# EAGLE design driver (EAGLE 9.6.2)
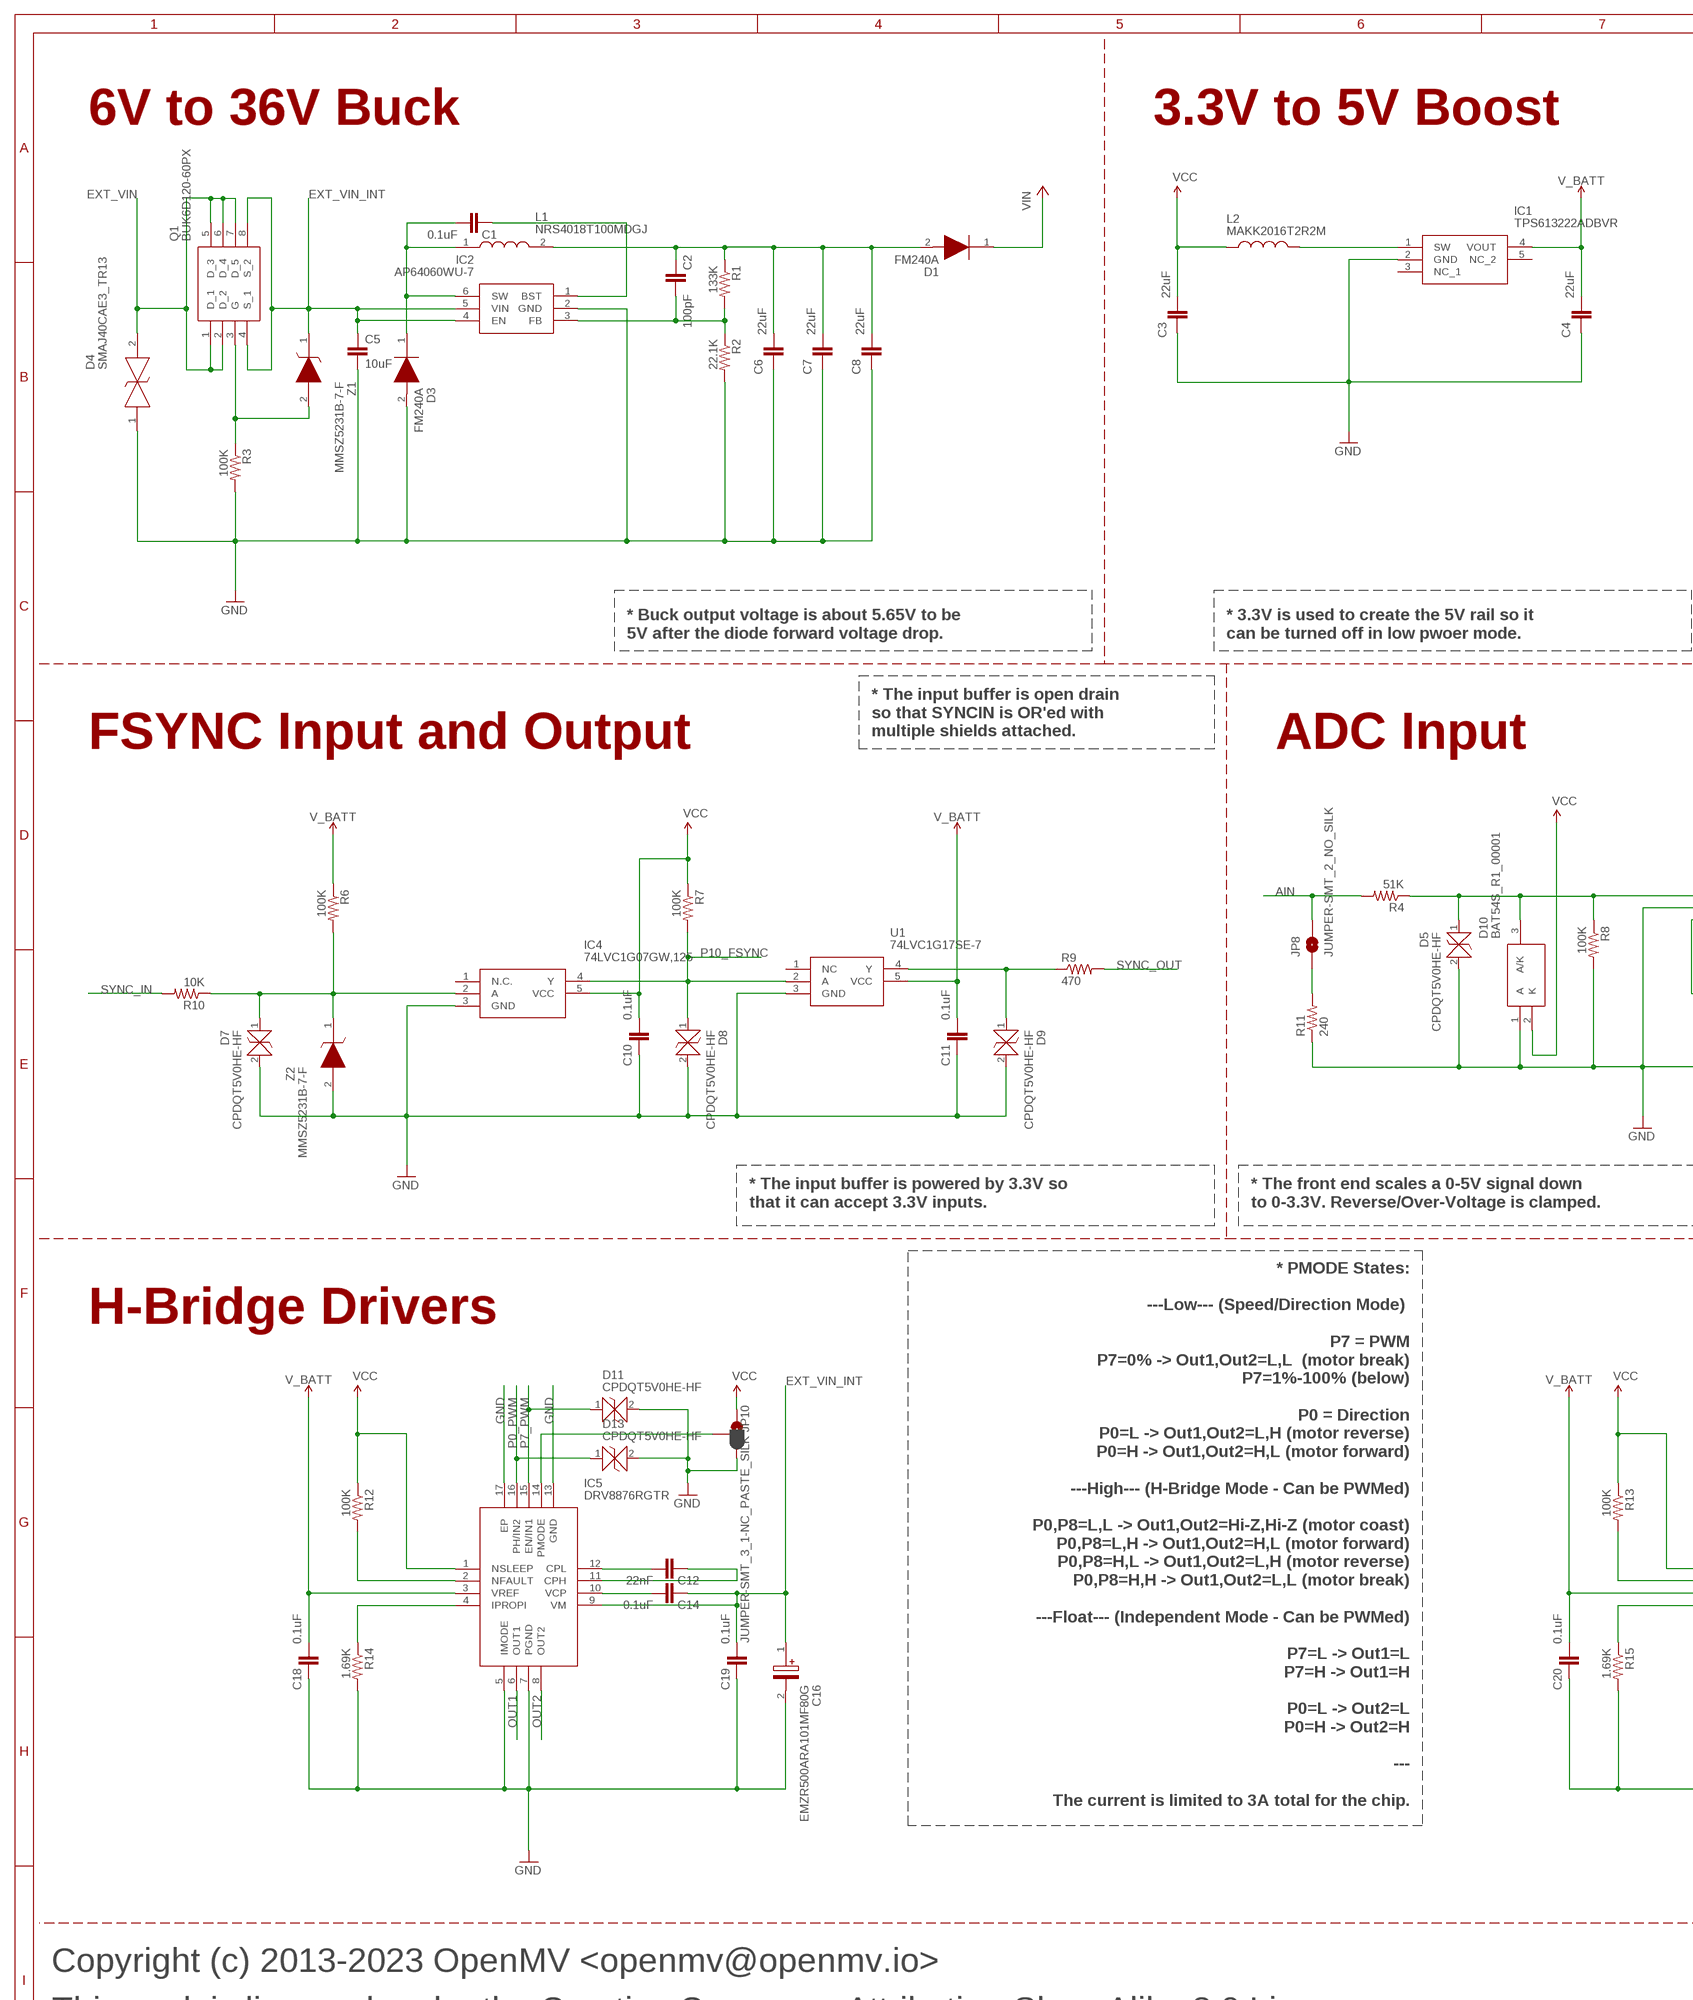
[diagram p0: schematic, sheet 1, part 1 of 2]
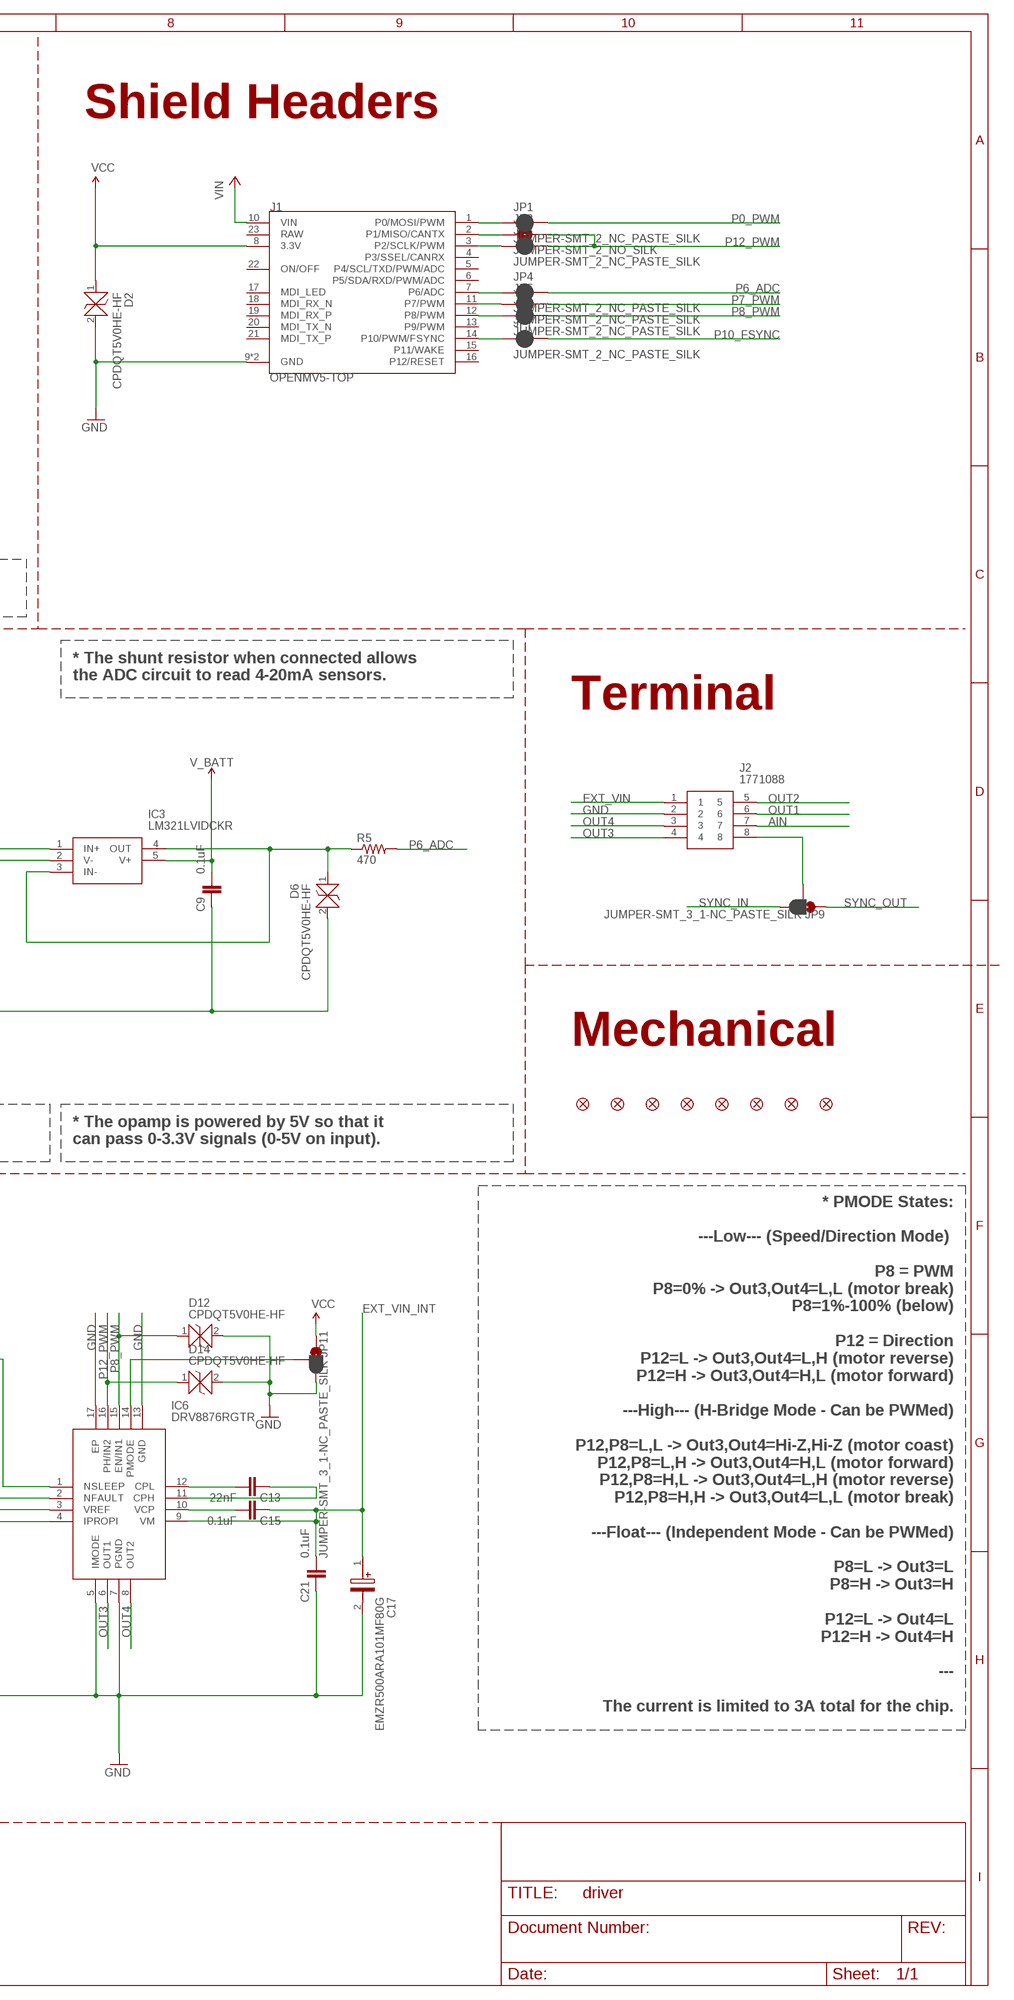
[diagram p1: schematic, sheet 1, part 2 of 2]

## Parts
C1  0.1uF  CAP0402-CAP  [0402-CAP]
C2  100pF  CAP0402-CAP  [0402-CAP]
C3  22uF  22UF-0805-6.3V-20%  [0805]
C4  22uF  22UF-0805-6.3V-20%  [0805]
C5  10uF  C-EUC0805  [C0805]
C6  22uF  22UF-0805-6.3V-20%  [0805]
C7  22uF  22UF-0805-6.3V-20%  [0805]
C8  22uF  22UF-0805-6.3V-20%  [0805]
C9  0.1uF  CAP0402-CAP  [0402-CAP]
C10  0.1uF  CAP0402-CAP  [0402-CAP]
C11  0.1uF  CAP0402-CAP  [0402-CAP]
C12  22nF  CAP0402-CAP  [0402-CAP]
C13  22nF  CAP0402-CAP  [0402-CAP]
C14  0.1uF  CAP0402-CAP  [0402-CAP]
C15  0.1uF  CAP0402-CAP  [0402-CAP]
C16  EMZR500ARA101MF80G  [CAPAE660X820N]
C17  EMZR500ARA101MF80G  [CAPAE660X820N]
C18  0.1uF  CAP0402-CAP  [0402-CAP]
C19  0.1uF  CAP0402-CAP  [0402-CAP]
C20  0.1uF  CAP0402-CAP  [0402-CAP]
C21  0.1uF  CAP0402-CAP  [0402-CAP]
D1  FM240A  [DIOM5025X231N]
D2  CPDQT5V0HE-HF  [CPDQT5V0HEHF]
D3  FM240A  [DIOM5025X231N]
D4  SMAJ40CAE3_TR13  [SMAJ40CAE3TR13]
D5  CPDQT5V0HE-HF  [CPDQT5V0HEHF]
D6  CPDQT5V0HE-HF  [CPDQT5V0HEHF]
D7  CPDQT5V0HE-HF  [CPDQT5V0HEHF]
D8  CPDQT5V0HE-HF  [CPDQT5V0HEHF]
D9  CPDQT5V0HE-HF  [CPDQT5V0HEHF]
D10  BAT54S_R1_00001  [SOT95P240X110-3N]
D11  CPDQT5V0HE-HF  [CPDQT5V0HEHF]
D12  CPDQT5V0HE-HF  [CPDQT5V0HEHF]
D13  CPDQT5V0HE-HF  [CPDQT5V0HEHF]
D14  CPDQT5V0HE-HF  [CPDQT5V0HEHF]
FD1  FIDUCIAL1X2  [FIDUCIAL-1X2]
FD2  FIDUCIAL1X2  [FIDUCIAL-1X2]
FD3  FIDUCIAL1X2  [FIDUCIAL-1X2]
FD4  FIDUCIAL1X2  [FIDUCIAL-1X2]
FD5  FIDUCIAL1X2  [FIDUCIAL-1X2]
FD6  FIDUCIAL1X2  [FIDUCIAL-1X2]
FD7  FIDUCIAL1X2  [FIDUCIAL-1X2]
FD8  FIDUCIAL1X2  [FIDUCIAL-1X2]
IC1  TPS613222ADBVR  [SOT95P280X145-5N]
IC2  AP64060WU-7  [SOT95P280X100-6N]
IC3  LM321LVIDCKR  [SOT65P210X110-5N]
IC4  74LVC1G07GW,125  [SOT65P212X110-5N]
IC5  DRV8876RGTR  [QFN50P300X300X100-17N]
IC6  DRV8876RGTR  [QFN50P300X300X100-17N]
J1  OPENMV5-TOP  [OPENMV5-TOP]
J2  1771088  [1771088]
JP1  JUMPER-SMT_2_NC_PASTE_SILK  [SMT-JUMPER_2_NC_PASTE_SILK]
JP2  JUMPER-SMT_2_NO_SILK  [SMT-JUMPER_2_NO_SILK]
JP3  JUMPER-SMT_2_NC_PASTE_SILK  [SMT-JUMPER_2_NC_PASTE_SILK]
JP4  JUMPER-SMT_2_NC_PASTE_SILK  [SMT-JUMPER_2_NC_PASTE_SILK]
JP5  JUMPER-SMT_2_NC_PASTE_SILK  [SMT-JUMPER_2_NC_PASTE_SILK]
JP6  JUMPER-SMT_2_NC_PASTE_SILK  [SMT-JUMPER_2_NC_PASTE_SILK]
JP7  JUMPER-SMT_2_NC_PASTE_SILK  [SMT-JUMPER_2_NC_PASTE_SILK]
JP8  JUMPER-SMT_2_NO_SILK  [SMT-JUMPER_2_NO_SILK]
JP9  JUMPER-SMT_3_1-NC_PASTE_SILK  [SMT-JUMPER_3_1-NC_PASTE_SILK]
JP10  JUMPER-SMT_3_1-NC_PASTE_SILK  [SMT-JUMPER_3_1-NC_PASTE_SILK]
JP11  JUMPER-SMT_3_1-NC_PASTE_SILK  [SMT-JUMPER_3_1-NC_PASTE_SILK]
L1  NRS4018T100MDGJ  [NRS4018T100MDGJ]
L2  MAKK2016T2R2M  [INDC2016X100N]
Q1  BUK6D120-60PX  [BUK6D12060PX]
R1  133K  RESISTOR0402-RES  [0402-RES]
R2  22.1K  RESISTOR0402-RES  [0402-RES]
R3  100K  RESISTOR0402-RES  [0402-RES]
R4  51K  RESISTOR0402-RES  [0402-RES]
R5  470  R-US_R0603  [R0603]
R6  100K  RESISTOR0402-RES  [0402-RES]
R7  100K  RESISTOR0402-RES  [0402-RES]
R8  100K  RESISTOR0402-RES  [0402-RES]
R9  470  R-US_R0603  [R0603]
R10  10K  RESISTOR0402-RES  [0402-RES]
R11  240  R-US_R0603  [R0603]
R12  100K  RESISTOR0402-RES  [0402-RES]
R13  100K  RESISTOR0402-RES  [0402-RES]
R14  1.69K  RESISTOR0402-RES  [0402-RES]
R15  1.69K  RESISTOR0402-RES  [0402-RES]
U1  74LVC1G17SE-7  [SOT65P210X110-5N]
Z1  MMSZ5231B-7-F  [SOD3716X145N]
Z2  MMSZ5231B-7-F  [SOD3716X145N]

## Nets
AIN [signal]: J2.7 JP8.2 R4.2
AIN_INT [signal]: D5.1 D10.3(A/K) IC3.1(IN+) R4.1 R8.1
AIN_OUT [signal]: D6.1 IC3.3(IN-) IC3.4(OUT) R5.1
AIN_S [signal]: JP8.1 R11.2
CPH0 [pwr]: C12.1 IC5.11(CPH)
CPH1 [pwr]: C13.1 IC6.11(CPH)
CPL0 [pwr]: C12.2 IC5.12(CPL)
CPL1 [pwr]: C13.2 IC6.12(CPL)
EXT_VIN [hipwr]: D4.2 J2.1 Q1.1(D_1) Q1.2(D_2) Q1.5(D_3) Q1.6(D_4) Q1.7(D_5)
EXT_VIN_BST [hipwr]: C1.1 IC2.1(BST)
EXT_VIN_FB [hipwr]: C2.2 IC2.3(FB) R1.2 R2.1
EXT_VIN_G [hipwr]: Q1.3(G) R3.1 Z1.2(A)
EXT_VIN_INT [hipwr]: C5.1 C14.1 C15.1 C16.1(+) C17.1(+) C19.2 C21.2 IC2.4(EN) IC2.5(VIN) IC5.9(VM) IC6.9(VM) Q1.4(S_1) Q1.8(S_2) Z1.1(K)
EXT_VIN_OUT [hipwr]: C2.1 C6.2 C7.2 C8.2 D1.2(A) L1.2 R1.1
EXT_VIN_SW [hipwr]: C1.2 D3.1(K) IC2.6(SW) L1.1
GND [gnd]: C3.1 C4.1 C5.2 C6.1 C7.1 C8.1 C9.1 C10.1 C11.1 C16.2(-) C17.2(-) C18.1 C19.1 C20.1 C21.1 D2.2 D3.2(A) D4.1 D5.2 D6.2 D7.2 D8.2 D9.2 D10.1(A) D11.2 D12.2 D13.2 D14.2 IC1.2(GND) IC2.2(GND) IC3.2(V-) IC4.3(GND) IC5.5(IMODE) IC5.7(PGND) IC5.13(GND) IC5.17(EP) IC6.5(IMODE) IC6.7(PGND) IC6.13(GND) IC6.17(EP) J1.9(GND) J1.24(GND) J2.2 JP10.3 JP11.3 R2.2 R3.2 R8.2 R11.1 R14.2 R15.2 U1.3(GND) Z2.2(A)
IPROPI0 [signal]: IC5.4(IPROPI) R14.1
IPROPI1 [signal]: IC6.4(IPROPI) R15.1
NFAULT0 [signal]: IC5.2(NFAULT) R12.2
NFAULT1 [signal]: IC6.2(NFAULT) R13.2
OUT1 [hipwr]: IC5.6(OUT1) J2.6
OUT2 [hipwr]: IC5.8(OUT2) J2.5
OUT3 [hipwr]: IC6.6(OUT1) J2.4
OUT4 [hipwr]: IC6.8(OUT2) J2.3
P0_PWM [signal]: D13.1 IC5.16(PH/IN2) JP1.2
P0_PWM_INT [signal]: J1.1(P0/MOSI/PWM) JP1.1
P1_PWM_INT [signal]: J1.2(P1/MISO/CANTX) JP2.1
P2_PWM_INT [signal]: J1.3(P2/SCLK/PWM) JP3.1
P6_ADC [signal]: JP4.2 R5.2
P6_ADC_INT [signal]: J1.7(P6/ADC) JP4.1
P7_PWM [signal]: D11.1 IC5.15(EN/IN1) JP5.2
P7_PWM_INT [signal]: J1.11(P7/PWM) JP5.1
P8_PWM [signal]: D12.1 IC6.15(EN/IN1) JP6.2
P8_PWM_INT [signal]: J1.12(P8/PWM) JP6.1
P10_FSYNC [signal]: D8.1 IC4.4(Y) JP7.2 R7.2 U1.2(A)
P10_FSYNC_INT [signal]: J1.14(P10/PWM/FSYNC) JP7.1
P12_PWM [signal]: D14.1 IC6.16(PH/IN2) JP2.2 JP3.2
PMODE0 [signal]: IC5.14(PMODE) JP10.2
PMODE1 [signal]: IC6.14(PMODE) JP11.2
SW [pwr]: IC1.1(SW) L2.2
SYNC [signal]: J2.8 JP9.2
SYNC_IN [signal]: JP9.3 R10.2
SYNC_IN_INT [signal]: D7.1 IC4.2(A) R6.2 R10.1 Z2.1(K)
SYNC_OUT [signal]: JP9.1 R9.2
SYNC_OUT_INT [signal]: D9.1 R9.1 U1.4(Y)
V_BATT [pwr]: C4.2 C9.2 C11.2 C18.2 C20.2 IC1.4(VOUT) IC3.5(V+) IC5.3(VREF) IC6.3(VREF) R6.1 U1.5(VCC)
VCC [pwr]: C3.2 C10.2 D2.1 D10.2(K) IC4.5(VCC) IC5.1(NSLEEP) IC6.1(NSLEEP) J1.8(3.3V) JP10.1 JP11.1 L2.1 R7.1 R12.1 R13.1
VCP0 [pwr]: C14.2 IC5.10(VCP)
VCP1 [pwr]: C15.2 IC6.10(VCP)
VIN [hipwr]: D1.1(K) J1.10(VIN)
Unconnected: IC1.3(NC_1) IC1.5(NC_2) IC4.1(N.C.) J1.4(P3/SSEL/CANRX) J1.5(P4/SCL/TXD/PWM/ADC) J1.6(P5/SDA/RXD/PWM/ADC) J1.13(P9/PWM) J1.15(P11/WAKE) J1.16(P12/RESET) J1.17(MDI_LED) J1.18(MDI_RX_N) J1.19(MDI_RX_P) J1.20(MDI_TX_N) J1.21(MDI_TX_P) J1.22(ON/OFF) J1.23(RAW) U1.1(NC)

## Notes on the sheet
- 6V to 36V Buck | 3.3V to 5V Boost | Shield Headers
- * Buck output voltage is about 5.65V to be
  5V after the diode forward voltage drop.
- * 3.3V is used to create the 5V rail so it
  can be turned off in low pwoer mode.
- * The shunt resistor when connected allows
  the ADC circuit to read 4-20mA sensors.
- * The input buffer is open drain
  so that SYNCIN is OR'ed with
  multiple shields attached.
- FSYNC Input and Output | ADC Input | Terminal
- Mechanical
- * The input buffer is powered by 3.3V so
  that it can accept 3.3V inputs.
- * The front end scales a 0-5V signal down
  to 0-3.3V. Reverse/Over-Voltage is clamped.
- * The opamp is powered by 5V so that it
  can pass 0-3.3V signals (0-5V on input).
- * PMODE States:
  
  ---Low--- (Speed/Direction Mode) 
  
  P7 = PWM
  P7=0% -> Out1,Out2=L,L  (motor break)
  P7=1%-100% (below)
  
  P0 = Direction
  P0=L -> Out1,Out2=L,H (motor reverse)
  P0=H -> Out1,Out2=H,L (motor forward)
  
  ---High--- (H-Bridge Mode - Can be PWMed)
  
  P0,P8=L,L -> Out1,Out2=Hi-Z,Hi-Z (motor coast)
  P0,P8=L,H -> Out1,Out2=H,L (motor forward)
  P0,P8=H,L -> Out1,Out2=L,H (motor reverse)
  P0,P8=H,H -> Out1,Out2=L,L (motor break)
  
  ---Float--- (Independent Mode - Can be PWMed)
  
  P7=L -> Out1=L
  P7=H -> Out1=H
  
  P0=L -> Out2=L
  P0=H -> Out2=H
  
  ---
  
  The current is limited to 3A total for the chip.
- * PMODE States:
  
  ---Low--- (Speed/Direction Mode) 
  
  P8 = PWM
  P8=0% -> Out3,Out4=L,L (motor break)
  P8=1%-100% (below)
  
  P12 = Direction
  P12=L -> Out3,Out4=L,H (motor reverse)
  P12=H -> Out3,Out4=H,L (motor forward)
  
  ---High--- (H-Bridge Mode - Can be PWMed)
  
  P12,P8=L,L -> Out3,Out4=Hi-Z,Hi-Z (motor coast)
  P12,P8=L,H -> Out3,Out4=H,L (motor forward)
  P12,P8=H,L -> Out3,Out4=L,H (motor reverse)
  P12,P8=H,H -> Out3,Out4=L,L (motor break)
  
  ---Float--- (Independent Mode - Can be PWMed)
  
  P8=L -> Out3=L
  P8=H -> Out3=H
  
  P12=L -> Out4=L
  P12=H -> Out4=H
  
  ---
  
  The current is limited to 3A total for the chip.
- H-Bridge Drivers
- Copyright (c) 2013-2023 OpenMV <openmv@openmv.io>
- This work is licensed under the Creative Commons Attribution-ShareAlike 3.0 License.
- To view a copy of this license, visit http://creativecommons.org/licenses/by-sa/3.0/

## Library data of the parts
C1 C9-C11 C14 C15 C18-C21 = sfe:CAP: Capacitor Standard 0603 ceramic capacitor, and 0.1" leaded capacitor.; MPN: GRM155R71H104KE14D
C2 = sfe:CAP: Capacitor Standard 0603 ceramic capacitor, and 0.1" leaded capacitor.; MPN: CC0402JRNPO9BN101
C3 C4 C6-C8 = SparkFun-Capacitors:22UF: 22µF ceramic capacitors A capacitor is a passive two-terminal electrical component used to store electrical energy temporarily in an electric field.; MPN: CL21A226MQQNNNE; PROD_ID: CAP-08402
C5 = rcl:C-EU: CAPACITOR, European symbol; MPN: GRM21BR61H106KE43K; SPICEPREFIX: C
C12 C13 = sfe:CAP: Capacitor Standard 0603 ceramic capacitor, and 0.1" leaded capacitor.; MPN: GRM155R71H223KA12D
C16 C17 = EMZR500ARA101MF80G:EMZR500ARA101MF80G: Aluminum Electrolytic Capacitors - SMD 100uF 50V 20% Source: Datasheet <https://datasheet.datasheetarchive.com/originals/distributors/DKDS-39/4980.pdf>; DESCRIPTION: Aluminum Electrolytic Capacitors - SMD 100uF 50V 20%; HEIGHT: 8.2mm; MANUFACTURER_NAME: Chemi-Con; MANUFACTURER_PART_NUMBER: EMZR500ARA101MF80G; MOUSER_PART_NUMBER: 661-EMZR500ARA101MF8; MOUSER_PRICE-STOCK: https://www.mouser.co.uk/ProductDetail/United-Chemi-Con/EMZR500ARA101MF80G?qs=y6ZabgHbY%252ByQ3zUEIlMmqw%3D%3D; MPN: EMZR500ARA101MF80G
D1 D3 = FM240A:FM240A: Diodes - General Purpose, Power, Switching GP Si Rectifier SMB,2A,40V Source: Datasheet <https://ms.componentsearchengine.com/Datasheets/1/FM240A.pdf>; DESCRIPTION: Diodes - General Purpose, Power, Switching GP Si Rectifier SMB,2A,40V; HEIGHT: 2.31mm; MANUFACTURER_NAME: Rectron; MANUFACTURER_PART_NUMBER: FM240A; MOUSER_PART_NUMBER: 583-FM240A; MOUSER_PRICE-STOCK: https://www.mouser.co.uk/ProductDetail/Rectron/FM240A?qs=7pEAo90IqNG7sknZwmLYhQ%3D%3D; MPN: FM240A
D2 D5-D9 D11-D14 = CPDQT5V0HE-HF:CPDQT5V0HE-HF: ESD Suppressors / TVS Diodes DIODE ESD 5VWM 65W 0402/SOD-923F Source: Datasheet <https://www.comchiptech.com/admin/files/product/CPDQT5V0HE-HF RevA.PDF>; DESCRIPTION: ESD Suppressors / TVS Diodes DIODE ESD 5VWM 65W 0402/SOD-923F; HEIGHT: 0.42mm; MANUFACTURER_NAME: Comchip Technology; MANUFACTURER_PART_NUMBER: CPDQT5V0HE-HF; MPN: CPDQT5V0HE-HF
D4 = SMAJ40CAe3_TR13:SMAJ40CAE3_TR13: ESD Suppressors / TVS Diodes TVS Source: Datasheet <https://www.arrow.com/en/products/smaj40cae3tr13/microchip-technology?region=nac>; DESCRIPTION: ESD Suppressors / TVS Diodes TVS; HEIGHT: 3.05mm; MANUFACTURER_NAME: Microchip; MANUFACTURER_PART_NUMBER: SMAJ40CAe3/TR13; MOUSER_PART_NUMBER: 494-SMAJ40CAE3/TR13; MOUSER_PRICE-STOCK: https://www.mouser.co.uk/ProductDetail/Microchip-Technology/SMAJ40CAe3-TR13?qs=pU29NIZ4ZwCw3PnlxOleOw%3D%3D; MPN: SMAJ40CAe3/TR13
D10 = BAT54S_R1_00001:BAT54S_R1_00001: Schottky Diodes & Rectifiers /L44/TR/7"/HF/3K/SOT-23/SKY/SOT/SSM-02TCS/SSM02-QI10/PJ/// Source: Datasheet <https://www.mouser.tw/datasheet/2/1057/BAT54_SERIES-1868754.pdf>; DESCRIPTION: Schottky Diodes & Rectifiers /L44/TR/7"/HF/3K/SOT-23/SKY/SOT/SSM-02TCS/SSM02-QI10/PJ///; HEIGHT: 1.1mm; MANUFACTURER_NAME: PANJIT; MANUFACTURER_PART_NUMBER: BAT54S_R1_00001; MOUSER_PART_NUMBER: 241-BAT54S_R1_00001; MOUSER_PRICE-STOCK: https://www.mouser.co.uk/ProductDetail/Panjit/BAT54S_R1_00001?qs=sPbYRqrBIVkGy01tP2E0cg%3D%3D; MPN: BAT54S_R1_00001
FD1-FD8 = SparkFun-Aesthetics:FIDUCIAL: Fiducial Alignment Points Point-of-reference for pick-and-place machines and other optical instruments.
IC1 = TPS613222ADBVR:TPS613222ADBVR: 6-uA Quiescent Current, 1.8-A Switch Current Boost Converter Source: Datasheet <http://www.ti.com/lit/gpn/tps61322>; DESCRIPTION: 6-uA Quiescent Current, 1.8-A Switch Current Boost Converter; HEIGHT: 1.45mm; MANUFACTURER_NAME: Texas Instruments; MANUFACTURER_PART_NUMBER: TPS613222ADBVR; MOUSER_PART_NUMBER: 595-TPS613222ADBVR; MOUSER_PRICE-STOCK: https://www.mouser.co.uk/ProductDetail/Texas-Instruments/TPS613222ADBVR?qs=W0yvOO0ixfE4d69WXsn8NQ%3D%3D; MPN: TPS613222ADBVR
IC2 = AP64060WU-7:AP64060WU-7: Switching Voltage Regulators DCDC Conv HV Buck TSOT26(STD) T&R 3K Source: Datasheet <https://www.diodes.com/assets/Datasheets/AP64060.pdf>; DESCRIPTION: Switching Voltage Regulators DCDC Conv HV Buck TSOT26(STD) T&R 3K; HEIGHT: 1mm; MANUFACTURER_NAME: Diodes Inc.; MANUFACTURER_PART_NUMBER: AP64060WU-7; MOUSER_PART_NUMBER: 621-AP64060WU-7; MOUSER_PRICE-STOCK: https://www.mouser.co.uk/ProductDetail/Diodes-Incorporated/AP64060WU-7?qs=Li%252BoUPsLEntiZYjFw%252BCbiQ%3D%3D; MPN: AP64060WU-7
IC3 = LM321LVIDCKR:LM321LVIDCKR: 1-Channel industry standard low voltage operational amplifier Source: Datasheet <http://www.ti.com/lit/gpn/LM321LV>; DESCRIPTION: 1-Channel industry standard low voltage operational amplifier; HEIGHT: 1.1mm; MANUFACTURER_NAME: Texas Instruments; MANUFACTURER_PART_NUMBER: LM321LVIDCKR; MOUSER_PART_NUMBER: 595-LM321LVIDCKR; MOUSER_PRICE-STOCK: https://www.mouser.co.uk/ProductDetail/Texas-Instruments/LM321LVIDCKR?qs=qSfuJ%252Bfl%2Fd6RcyTOjkRx5Q%3D%3D; MPN: LM321LVIDCKR
IC4 = 74LVC1G07GW_125:74LVC1G07GW,125: 74LVC1G07 - Buffer with open-drain output@en-us Source: Datasheet <https://assets.nexperia.com/documents/data-sheet/74LVC1G07.pdf>; DESCRIPTION: 74LVC1G07 - Buffer with open-drain output@en-us; HEIGHT: 1.1mm; MANUFACTURER_NAME: Nexperia; MANUFACTURER_PART_NUMBER: 74LVC1G07GW,125; MOUSER_PART_NUMBER: 771-74LVC1G07GW-G; MOUSER_PRICE-STOCK: https://www.mouser.co.uk/ProductDetail/Nexperia/74LVC1G07GW125?qs=me8TqzrmIYW763Mg%2FG86Uw%3D%3D; MPN: 74LVC1G07GW,125
IC5 IC6 = DRV8876RGTR:DRV8876RGTR: Motor / Motion / Ignition Controllers & Drivers 37-V, 3.5-A brushed DC motor driver with integrated current sensing and current sense output 16-VQFN -40 to 125 Source: Datasheet <http://www.ti.com/lit/gpn/drv8876>; DESCRIPTION: Motor / Motion / Ignition Controllers & Drivers 37-V, 3.5-A brushed DC motor driver with integrated current sensing and current sense output 16-VQFN -40 to 125; HEIGHT: 1mm; MANUFACTURER_NAME: Texas Instruments; MANUFACTURER_PART_NUMBER: DRV8876RGTR; MOUSER_PART_NUMBER: 595-DRV8876RGTR; MOUSER_PRICE-STOCK: https://www.mouser.co.uk/ProductDetail/Texas-Instruments/DRV8876RGTR?qs=T3oQrply3y%2F6lJwB3MIeHA%3D%3D; MPN: DRV8876RGTR
J1 = openmv5:OPENMV5-TOP
J2 = 1771088:1771088: PCB terminal block, nominal current: 6 A, rated voltage (III/2): 160 V, nominal cross section: 0.5 mm?, Number of potentials: 8, Number of rows: 1, Number of positions per row: 8, product range: PTSM 0,5/..-H-SMD, pitch: 2.5 mm, connection method: Push-in spring connection, mounting: SMD soldering, conductor/PCB connection direction: 0 ?, color: black, Pin layout: Linear pad geometry, type of packaging: packed in cardboard Source: Datasheet <http://www.phoenixcontact.net/product/1771088>; DESCRIPTION: PCB terminal block, nominal current: 6 A, rated voltage (III/2): 160 V, nominal cross section: 0.5 mm?, Number of potentials: 8, Number of rows: 1, Number of positions per row: 8, product range: PTSM 0,5/..-H-SMD, pitch: 2.5 mm, connection method: Push-in spring connection, mounting: SMD soldering, conductor/PCB connection direction: 0 ?, color: black, Pin layout: Linear pad geometry, type of packaging: packed in cardboard; HEIGHT: 5.22mm; MANUFACTURER_NAME: Phoenix Contact; MANUFACTURER_PART_NUMBER: 1771088; MOUSER_PART_NUMBER: 651-1771088; MOUSER_PRICE-STOCK: https://www.mouser.co.uk/ProductDetail/Phoenix-Contact/1771088?qs=Q77YN%2FRrsKIDMojcNKtpFQ%3D%3D; MPN: 1771088
JP1 JP3-JP7 = SparkFun-Jumpers:JUMPER-SMT_2_NC_PASTE: Normally closed solder jumper This jumper has an aperture in the stencil to allow solder paste to bridge the split in the wire so it's normally closed (NC). Wick off the solder to open the connection. Reapply solder to reclose the connection.
JP2 JP8 = SparkFun-Jumpers:JUMPER-SMT_2_NO: Normally open jumper This jumper has two pads in close proximity to each other. Apply solder to close the connection. Round pads are easier to solder for beginners, but are a lot larger. SparkFun Product that uses the round pads: SparkFun EL Sequencer <https://www.sparkfun.com/products/12781>
JP9-JP11 = SparkFun-Jumpers:JUMPER-SMT_3_1-NC_PASTE: Normally closed solder jumper (1 of 2 connections) This jumper has an aperture in the stencil to allow solder paste to bridge one of the two connections. One connection is normally closed (NC), while the other is normally open (NO). Wick off the solder to open the connection. Reapply solder to reclose the connection. Apply solder to the other side instead to change the current path.
L1 = NRS4018T100MDGJ:NRS4018T100MDGJ: Fixed Inductors 4018 10uH 180mOhms +/-20%Tol 1200mA Source: Datasheet <https://datasheet.datasheetarchive.com/originals/distributors/Datasheets-DGA11/2190952.pdf>; DESCRIPTION: Fixed Inductors 4018 10uH 180mOhms +/-20%Tol 1200mA; HEIGHT: 1mm; MANUFACTURER_NAME: TAIYO YUDEN; MANUFACTURER_PART_NUMBER: NRS4018T100MDGJ; MOUSER_PART_NUMBER: 963-NRS4018T100MDGJ; MOUSER_PRICE-STOCK: https://www.mouser.co.uk/ProductDetail/TAIYO-YUDEN/NRS4018T100MDGJ?qs=PzICbMaShUeiyHfvjt6KEw%3D%3D; MPN: NRS4018T100MDGJ
L2 = MAKK2016T2R2M:MAKK2016T2R2M: INDUCTOR, METAL CORE Check availability <https://pricing.snapeda.com/parts/MAKK2016T2R2M/Taiyo%20Yuden/view-part?ref=eda>; AVAILABILITY: In Stock; DESCRIPTION: 2.2 µH Shielded Drum Core, Wirewound Inductor 1.5 A 160mOhm Max 0806 (2016 Metric); MF: Taiyo Yuden; MP: MAKK2016T2R2M; MPN: MAKK2016T2R2M; PACKAGE: 2016 Taiyo Yuden; PRICE: None; PURCHASE-URL: https://pricing.snapeda.com/search/part/MAKK2016T2R2M/?ref=eda
Q1 = BUK6D120-60PX:BUK6D120-60PX: MOSFET 60V P-CH TRENCHMOS SOT1220 Source: Datasheet <https://componentsearchengine.com/Datasheets/2/BUK6D120-60PX.pdf>; DESCRIPTION: MOSFET 60V P-CH TRENCHMOS SOT1220; HEIGHT: 0.65mm; MANUFACTURER_NAME: Nexperia; MANUFACTURER_PART_NUMBER: BUK6D120-60PX; MOUSER_PART_NUMBER: 771-BUK6D120-60PX; MOUSER_PRICE-STOCK: https://www.mouser.co.uk/ProductDetail/Nexperia/BUK6D120-60PX?qs=F5EMLAvA7IBtoNC2L3hOcQ%3D%3D; MPN: BUK6D120-60PX
R1 = sfe:RESISTOR: Resistor Basic schematic elements and footprints for 0603, 1206, and PTH resistors.; MPN: RC0402FR-07133KL
R2 = sfe:RESISTOR: Resistor Basic schematic elements and footprints for 0603, 1206, and PTH resistors.; MPN: CR0402-FX-2212GLF
R3 R6-R8 R12 R13 = sfe:RESISTOR: Resistor Basic schematic elements and footprints for 0603, 1206, and PTH resistors.; MPN: AC0402FR-07100KL
R4 = sfe:RESISTOR: Resistor Basic schematic elements and footprints for 0603, 1206, and PTH resistors.; MPN: RC0402JR-0751KL
R5 R9 = rcl:R-US_: RESISTOR, American symbol; MPN: CR0603-FX-4700ELF; SPICEPREFIX: R
R10 = sfe:RESISTOR: Resistor Basic schematic elements and footprints for 0603, 1206, and PTH resistors.; MPN: AC0402FR-1310KL
R11 = rcl:R-US_: RESISTOR, American symbol; MPN: RK73B1JTTD241J; SPICEPREFIX: R
R14 R15 = sfe:RESISTOR: Resistor Basic schematic elements and footprints for 0603, 1206, and PTH resistors.; MPN: RC0402FR-07169RL
U1 = 74LVC1G17SE-7:74LVC1G17SE-7: DiodesZetex 74LVC1G17SE-7, Buffer, Push-Pull, Non-Inverting, 1.65 5.5 V, 5-Pin SOT-353 Source: Datasheet <https://componentsearchengine.com/Datasheets/2/74LVC1G17SE-7.pdf>; DESCRIPTION: DiodesZetex 74LVC1G17SE-7, Buffer, Push-Pull, Non-Inverting, 1.65 5.5 V, 5-Pin SOT-353; HEIGHT: 1.1mm; MANUFACTURER_NAME: Diodes Inc.; MANUFACTURER_PART_NUMBER: 74LVC1G17SE-7; MOUSER_PART_NUMBER: 621-74LVC1G17SE-7; MOUSER_PRICE-STOCK: https://www.mouser.co.uk/ProductDetail/Diodes-Incorporated/74LVC1G17SE-7?qs=FRHfhEBFk1dzIcstjqNcyA%3D%3D; MPN: 74LVC1G17SE-7
Z1 Z2 = MMSZ5231B-7-F:MMSZ5231B-7-F: Zener Diode 5.1V 5% 500mW SOD123 Diodes Inc MMSZ5231B-7-F Zener Diode, 5.1V 5% 0.5 W SMT 2-Pin SOD-123 Source: Datasheet <https://www.diodes.com/assets/Datasheets/ds18010.pdf>; DESCRIPTION: Zener Diode 5.1V 5% 500mW SOD123 Diodes Inc MMSZ5231B-7-F Zener Diode, 5.1V 5% 0.5 W SMT 2-Pin SOD-123; HEIGHT: 1.45mm; MANUFACTURER_NAME: Diodes Inc.; MANUFACTURER_PART_NUMBER: MMSZ5231B-7-F; MOUSER_PART_NUMBER: 621-MMSZ5231B-F; MOUSER_PRICE-STOCK: https://www.mouser.co.uk/ProductDetail/Diodes-Incorporated/MMSZ5231B-7-F?qs=2ygBApjwyeMh7Sf0YL1qSw%3D%3D; MPN: MMSZ5231B-7-F

## Net classes
0 default: width 0.127 mm, drill 0.254 mm, clearance 0.127 mm
2 gnd: width 0.127 mm, drill 0.254 mm, clearance 0.127 mm to class 0, clearance 0.127 mm to class 1, clearance 0.127 mm
3 pwr: width 0.127 mm, drill 0.254 mm, clearance 0.127 mm to class 0, clearance 0.127 mm to class 1, clearance 0.127 mm to class 2, clearance 0.127 mm
4 signal: width 0.127 mm, drill 0.254 mm, clearance 0.127 mm to class 0, clearance 0.127 mm to class 1, clearance 0.127 mm to class 2, clearance 0.127 mm to class 3, clearance 0.127 mm
6 hipwr: width 0.127 mm, drill 0.254 mm, clearance 0.127 mm to class 0, clearance 0.127 mm to class 1, clearance 0.127 mm to class 2, clearance 0.127 mm to class 3, clearance 0.127 mm to class 4, clearance 0.127 mm to class 5, clearance 0.254 mm

## Board
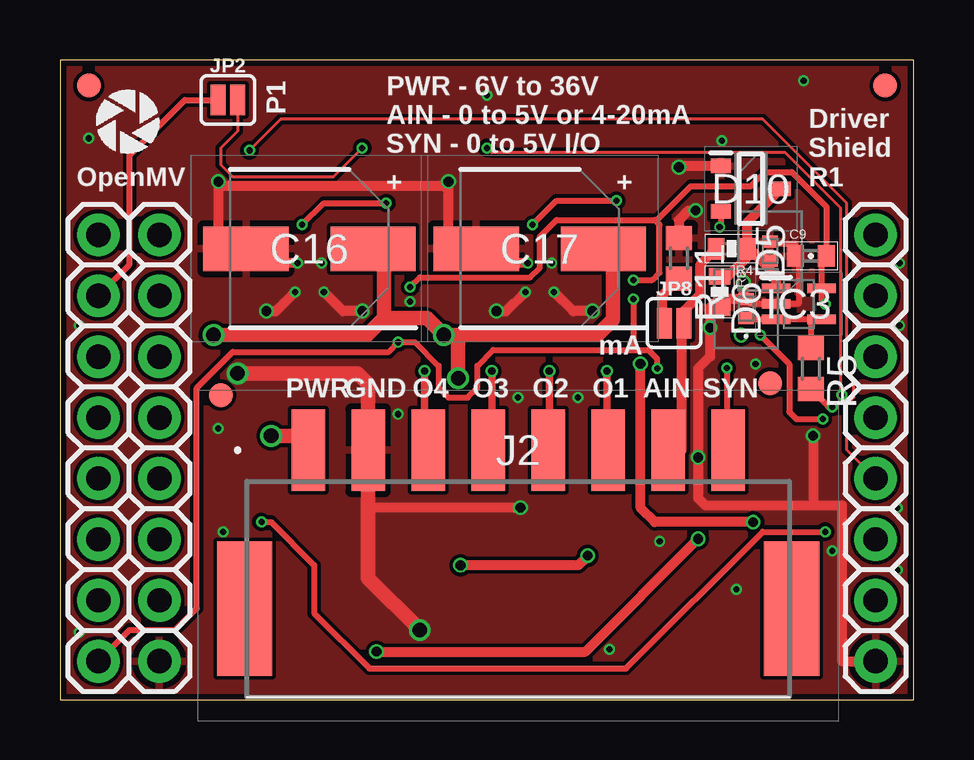
[diagram p2: board, top side]
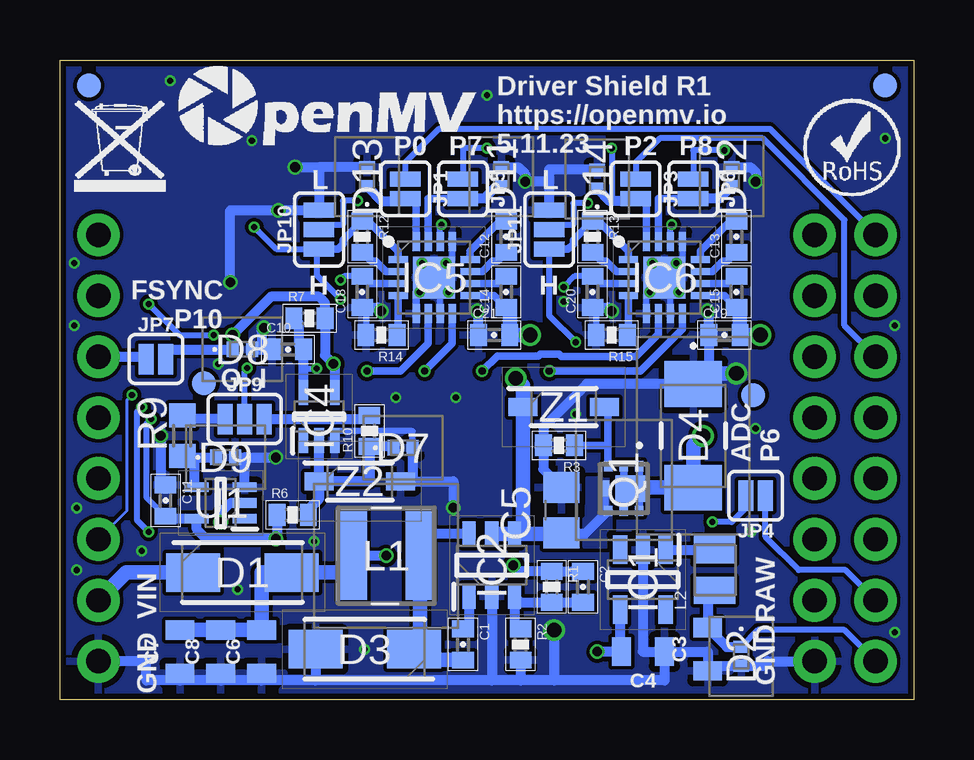
[diagram p3: board, bottom side, seen from below]

Size 35.6 x 26.67 mm. Coordinates in mm from the lower left corner, seen from the top.
Outline: 0,0 35.6,0 35.6,26.67 0,26.67 0,0
Copper layers (1*16): Top 0.035mm / dielectric 1.5mm / Bottom 0.035mm
Design rules "MF_Standard_2_Layer *": minimum track width 5mil, minimum drill 10mil, track to track 5mil, track to pad 5mil, pad to pad 5mil, via to via 5mil, smd to smd 0mil, copper to edge 10mil, drill to drill 10mil, minimum pad ring 4mil, minimum via ring 4mil, stop-mask expansion 2mil, vias tented up to drill 25mil, thermal gap 10mil

### Footprints (pad centres in the part's own frame; a part is rotated, then mirrored left to right if it is on the bottom)
0402-CAP = smd 0.7 x 0.9: 1 -0.65,0; 2 0.65,0
0805 = smd 0.8 x 1.2: 1 -0.9,0; 2 0.9,0
C0805 = smd 1.3 x 1.5: 1 -0.95,0; 2 0.95,0
CAPAE660X820N = smd 3.55 x 1.85: 1 -2.65,0; 2 2.65,0
DIOM5025X231N = smd 2.25 x 1.6: 1 -2.05,0; 2 2.05,0
CPDQT5V0HEHF = smd 0.5 x 0.65: 1 -0.4,0; 2 0.4,0
SMAJ40CAE3TR13 = smd 1.9 x 2.39: 1 -2.16,0; 2 2.16,0
SOT95P240X110-3N = smd 0.85 x 0.6: 1 -1.25,0.95; 2 -1.25,-0.95; 3 1.25,0
FIDUCIAL-1X2 = smd 1 x 1: 1 0,0
SOT95P280X145-5N = smd 1.2 x 0.6: 1 -1.25,0.95; 2 -1.25,0; 3 -1.25,-0.95; 4 1.25,-0.95; 5 1.25,0.95
SOT95P280X100-6N = smd 1.05 x 0.55: 1 -1.3,0.95; 2 -1.3,0; 3 -1.3,-0.95; 4 1.3,-0.95; 5 1.3,0; 6 1.3,0.95
SOT65P210X110-5N = smd 1.2 x 0.4: 1 -0.95,0.65; 2 -0.95,0; 3 -0.95,-0.65; 4 0.95,-0.65; 5 0.95,0.65
SOT65P212X110-5N = smd 1.05 x 0.4: 1 -1,0.65; 2 -1,0; 3 -1,-0.65; 4 1,-0.65; 5 1,0.65
QFN50P300X300X100-17N = smd 0.8 x 0.3: 1 -1.5,0.75; 2 -1.5,0.25; 3 -1.5,-0.25; 4 -1.5,-0.75; 9 1.5,-0.75; 10 1.5,-0.25; 11 1.5,0.25; 12 1.5,0.75 | smd 0.3 x 0.8: 5 -0.75,-1.5; 6 -0.25,-1.5; 7 0.25,-1.5; 8 0.75,-1.5; 13 0.75,1.5; 14 0.25,1.5; 15 -0.25,1.5; 16 -0.75,1.5 | smd 1.75 x 1.75: 17 0,0
OPENMV5-TOP = drill 1.016 pad 1.778: 1 1.6,19.38; 2 1.6,16.84; 3 1.6,14.3; 4 1.6,11.76; 5 1.6,9.22; 6 1.6,6.68; 7 1.6,4.14; 8 1.6,1.6; 9 34,1.6; 10 34,4.14; 11 34,6.68; 12 34,9.22; 13 34,11.76; 14 34,14.3; 15 34,16.84; 16 34,19.38; 17 4.14,19.38; 18 4.14,16.84; 19 4.14,14.3; 20 4.14,11.76; 21 4.14,9.22; 22 4.14,6.68; 23 4.14,4.14; 24 4.14,1.6
1771088 = smd 1.4 x 3.4: 1 -8.75,0; 2 -6.25,0; 3 -3.75,0; 4 -1.25,0; 5 1.25,0; 6 3.75,0; 7 6.25,0; 8 8.75,0 | smd 2.3 x 5.6: 9 -11.4,-6.6; 10 11.4,-6.6
SMT-JUMPER_2_NC_PASTE_SILK = smd 0.635 x 1.27: 1 -0.406,0; 2 0.406,0
SMT-JUMPER_2_NO_SILK = smd 0.635 x 1.27: 1 -0.406,0; 2 0.406,0
SMT-JUMPER_3_1-NC_PASTE_SILK = smd 0.635 x 1.27: 1 -0.813,0; 2 0,0; 3 0.813,0
NRS4018T100MDGJ = smd 1.2 x 3.7: 1 -1.4,0; 2 1.4,0
INDC2016X100N = smd 1.14 x 1.73: 1 -0.847,0; 2 0.847,0
BUK6D12060PX = smd 0.43 x 0.35: 1 0.935,-0.65; 2 0.935,0; 3 0.935,0.65; 4 -0.935,0.65; 5 -0.935,0; 6 -0.935,-0.65 | smd 1.1 x 1.25: 7 0,-0.285 | smd 0.66 x 0.35: 8 0,0.775
0402-RES = smd 0.7 x 0.9: 1 -0.65,0; 2 0.65,0
R0603 = smd 1 x 1.1: 1 -0.85,0; 2 0.85,0
SOT65P210X110-5N' = smd 1 x 0.4: 1 -1,0.65; 2 -1,0; 3 -1,-0.65; 4 1,-0.65; 5 1,0.65
SOD3716X145N = smd 1.2 x 0.75: 1 -1.7,0; 2 1.7,0

### Placement (x,y rotation side)
C1  18.8,2.3 270 bottom
C2  13.8,4.7 270 bottom
C3  8.6,2.1 90 bottom
C4  11.3,2 180 bottom
C5  14.7,7.9 90 bottom
C6  27.2,2 90 bottom
C7  30.6,2 90 bottom
C8  28.9,2 90 bottom
C9  31.3,18.5 0 top
C10  26.1,14.6 0 bottom
C11  31.2,8.3 270 bottom
C12  17,19.3 90 bottom
C13  7.4,19.3 90 bottom
C14  17,17 90 bottom
C15  7.4,17 90 bottom
C16  10.4,18.8 180 top
C17  20,18.8 180 top
C18  23,17 90 bottom
C19  7.9,15.2 0 bottom
C20  13.4,17 90 bottom
C21  17.5,15.2 0 bottom
D1  28,5.3 0 bottom
D2  7.2,1.8 270 bottom
D3  22.9,2.1 180 bottom
D4  9.2,11 270 bottom
D5  29.6,18.7 90 top
D6  28.6,16.3 90 top
D7  21.3,10.5 0 bottom
D8  28,14.6 0 bottom
D9  28.7,10.1 0 bottom
D10  28.8,21.3 0 top
D11  17.2,21.8 90 bottom
D12  7.6,21.8 90 bottom
D13  22.8,21.8 90 bottom
D14  13.2,21.7 90 bottom
FD1  29.6,13.2 0 top
FD2  29.6,13.2 0 bottom
FD3  6.7,12.7 0 top
FD4  6.7,12.7 0 bottom
FD5  34.4,25.6 0 top
FD6  34.4,25.6 0 bottom
FD7  1.2,25.6 0 top
FD8  1.2,25.6 0 bottom
IC1  11.3,5 270 bottom
IC2  17.6,5.6 90 bottom
IC3  30.8,16.5 0 top
IC4  24.8,11.8 90 bottom
IC5  20,17.6 0 bottom
IC6  10.4,17.6 0 bottom
J1  0,0 0 top
J2  19.1,10.4 0 top
JP1  21.2,21.3 270 bottom
JP2  7,25 0 top
JP3  11.6,21.3 270 bottom
JP4  6.6,8.5 180 bottom
JP5  18.8,21.3 270 bottom
JP6  9.2,21.3 270 bottom
JP7  31.6,14.2 0 bottom
JP8  25.6,15.7 0 top
JP9  27.9,11.7 0 bottom
JP10  24.8,19.6 90 bottom
JP11  15.2,19.6 90 bottom
L1  22,6 180 bottom
L2  8.3,5.4 90 bottom
Q1  12.1,8.8 90 bottom
R1  15.1,4.7 270 bottom
R2  16.4,2.3 270 bottom
R3  14.8,10.6 180 bottom
R4  28,18.8 180 top
R5  31.3,13.8 270 top
R6  25.9,7.7 0 bottom
R7  25.2,15.9 0 bottom
R8  27.5,17 270 top
R9  30.5,11 90 bottom
R10  22.7,11.2 90 bottom
R11  25.8,18.4 270 top
R12  23,19.3 270 bottom
R13  13.4,19.3 270 bottom
R14  22.2,15.2 180 bottom
R15  12.6,15.2 180 bottom
U1  74LVC1G17SE-7  [SOT65P210X110-5N']  28.9,8.2 180 bottom
U$1  [WEEE]  35,21.2 0 bottom
U$2  [ROHS]  4.6,21 0 bottom
U$3  [OMV-LOGO]  30.8,22.9 0 bottom
U$9  OPENMV-LOGO  [OPENMV-LOGO]  1.4,22.6 0 top
Z1  14.6,12.2 0 bottom
Z2  23.1,9.1 0 bottom

### Tracks (layer width: path | path; a pad name or v marks a point on that pad's centre or on a via)
AIN
  Top 0.406: J2.7 25.91,10.4 25.91,15.6 JP8.2 26.01,16.21 26.7,16.9 26.7,18.15 R4.2
AIN_INT
  Top 0.406: R4.1 28.65,18.45 27.85,17.65 R8.1 | R4.1 28.75,18.8 29.43,18.12 | 29.43,18.12 29.85,17.7 IC3.1 | D5.1 29.43,18.12 | R4.1 28.65,19.9 D10.3
AIN_OUT
  Top 0.254: R5.1 31.3,15.7 31.45,15.85 IC3.4 IC3.3 28.65,15.85 D6.1
AIN_S
  Top 0.406: JP8.1 25.09,15.8 25.09,16.84 R11.2
CPH0
  Bottom 0.305: C12.1 17.37,18.28 17.57,18.28 18,17.85 IC5.11
CPH1
  Bottom 0.305: C13.1 7.77,18.28 7.97,18.28 8.39,17.85 IC6.11
CPL0
  Bottom 0.305: C12.2 17.25,19.95 18.5,18.7 IC5.12
CPL1
  Bottom 0.305: IC6.12 8.9,18.7 7.65,19.95 C13.2
EXT_VIN  (via drill 0.61)
  Top 0.61: v8.8,11 10.35,11 J2.1
  Bottom 0.305: Q1.1 11.45,9.09 11.2,8.84 | Q1.2 12.1,9.09 | 12.1,9.09 Q1.7 | Q1.5 12.1,9.09 | Q1.6 11.45,8.52 11.78,8.84
  Bottom 0.61: v8.8,11 9.2,10.6 D4.2 11.2,8.84 11.78,8.84 Q1.7
EXT_VIN_BST
  Bottom 0.406: IC2.1 18.55,3.2 C1.1
EXT_VIN_FB
  Bottom 0.406: R2.1 16.65,2.95 IC2.3 16.4,4.05 R1.2 C2.2
EXT_VIN_G
  Bottom 0.305: Q1.3 12.75,10.6 | Z1.2 12.75,12.05 12.75,10.8 12.75,10.6 | R3.1 12.75,10.6
EXT_VIN_INT  (via drill 0.61)
  Top 0.61: v16.6,13.4 16.6,15.2 | 16.6,15.2 22.4,15.2 23.05,15.85 23.05,18.7 C17.1 | 13.5,15.9 13.5,18.8 C16.1 | 13.5,15.9 12.8,15.2 v6.4,15.2 | 16.6,15.2 v16,15.2 15.3,15.9 13.5,15.9
  Bottom 0.305: Q1.4 12.88,7.87 Q1.8 | C14.1 17.5,16.85 IC5.9 | C15.1 7.9,16.85 IC6.9
  Bottom 0.406: 14.7,6.9 13.71,6.9 Q1.4
  Bottom 0.61: C15.1 7.25,16.2 C19.2 v6.4,15.2 | C14.1 16.85,16.2 C21.2 v16,15.2 | v16.6,13.4 16.3,13.1 Z1.1 16.3,6.9 IC2.4 | IC2.4 IC2.5 | IC2.4 14.7,6.9 C5.1
  pour Bottom (no thermals): 13.7,7.5 13.6,7.5 13.6,9.2 12.7,9.2 12.7,6.4 13.7,6.4
EXT_VIN_OUT  (via drill 0.41)
  Top 0.406: v22,6 21.6,5.6 v16.7,5.6
  Bottom 0.406: v16.7,5.6 16.45,5.35 R1.1 C2.1 | v22,6 L1.2
  Bottom 0.61: C7.2 C8.2 C6.2 27.2,5.3 D1.2 23.4,5.3 L1.2
EXT_VIN_SW
  Bottom 0.406: IC2.6 20.6,6.9 L1.1
  Bottom 0.61: C1.2 20.4,1.65 D3.1 20.6,2.1 L1.1
GND  (via drill 0.25, 0.41, 0.61)
  Top 0.254: D6.2 28.8,16.5 IC3.2 30.8,16.5 30.8,18.5 C9.1 30.65,19 29.7,19 D5.2
  Top 0.406: v31.4,11 31.4,8.1 | J1.9 32.6,1.6 32.6,8.1 31.4,8.1 | v19.2,8 12.85,8 | 31.4,8.1 26.9,8.1 26.6,8.4 v26.6,10.1 26.6,13.8 27.1,14.3 v27.1,15.5 27.1,16.35 R8.2 27.85,16.7 D6.2 28.5,16.8 v28.5,17.4 | R11.1 25.8,20 26.2,20.4 v26.5,20.4 | C17.2 16.8,18.8 | 16.8,18.8 16.2,18.8 v16.2,21.6 16,21.4 6.8,21.4 v6.6,21.6 6.6,18.8 C16.2 8.05,18.2 v9.9,18.2 | v8.6,16.2 9,16.2 v9.8,17 | v18.2,16.2 18.6,16.2 v19.4,17 | v19.5,18.2 17.4,18.2 16.8,18.8 | v12.6,16.2 11.8,16.2 v11,17 | v22.2,16.2 21.4,16.2 v20.6,17 | D10.1 25.85,22.25 v25.8,22.2
  Top 0.61: v15,2.9 12.85,5.05 12.85,8 J2.2 12.85,13.15 12.4,13.6 v7.4,13.6
  Bottom 0.254: D7.2 20.9,11.2 24.15,11.2 IC4.3 | IC6.13 9.65,17.6 10.15,17.6 | 10.15,17.6 IC6.17 11.15,17.6 IC6.5 | IC6.7 10.15,17.6 | IC5.7 19.75,17.6 IC5.17 | C20.1 13.25,16.2 R15.2 | C18.1 22.85,16.2 R14.2 | IC5.13 19.25,18.25 19.3,18.2 v19.5,18.2
  Bottom 0.305: IC5.17 20,18.2 v20.5,18.2 | IC5.17 20.6,17.6 v20.6,17 20.75,17 IC5.5 | IC5.17 20,17 v19.4,17 | IC5.17 19.5,17.6 v19.5,18.2 | IC6.17 10.4,17 v9.8,17 | IC6.17 9.9,17.6 v9.9,18.2 | IC6.17 10.4,18.2 v10.9,18.2 | IC6.17 11,17.6 v11,17
  Bottom 0.406: C4.1 8.6,2 C3.1 8.6,1.4 D2.2 6.3,1.4 6.1,1.6 J1.24 | IC1.2 11.3,2 C4.1 | C4.1 10.4,0.8 15,0.8 | 15,0.8 16.4,0.8 | 16.4,0.8 17.6,0.8 | 17.6,0.8 24.95,0.8 | 24.95,0.8 27.2,0.8 | 27.2,0.8 28.9,0.8 | 28.9,0.8 30.6,0.8 | 30.6,0.8 32,0.8 32,1.6 J1.9 | D3.2 24.95,0.8 | C6.1 27.2,0.8 | C8.1 28.9,0.8 | C7.1 30.6,0.8 | IC2.2 17.6,0.8 | R2.2 16.4,0.8 | C5.2 15.45,9.6 R3.2 15.45,11.35 13.64,13.16 D4.1 8.55,13.81 C19.1 8.55,16.15 v8.6,16.2 | v15,2.9 15,0.8 | U1.3 27.9,10.1 D9.2 v26.6,10.1 | C11.1 31.4,9.15 v31.4,11 | D7.2 20.9,9.1 Z2.2 19.2,9.1 v19.2,8 | D8.2 27.2,14.6 | 27.2,14.6 C10.1 | v27.1,15.5 27.2,15.4 27.2,14.6 | v28.5,17.4 28.5,20.4 v26.5,20.4 JP10.3 24.8,22.2 | D12.2 6.8,22.2 6.6,22 v6.6,21.6 | D11.2 16.5,22.2 16.2,21.9 v16.2,21.6 15.2,21.6 | JP11.3 15.2,21.6 | 15.2,21.6 15.2,22.1 D14.2 | D13.2 24.8,22.2 | C21.1 18.15,16.15 v18.2,16.2 | C20.1 12.75,16.35 v12.6,16.2 | C18.1 22.35,16.35 v22.2,16.2 | v25.8,22.2 24.8,22.2
  Bottom 0.61: D4.1 8.76,13.6 v7.4,13.6
  other vias: 22.9,2.1 32.2,6.2 25,6.6 6.6,11.3 6.8,7 0.8,2.8 34.9,8 34.9,5.4 29,14 1.2,23.4 31,25.8 0.8,15.6 14.6,16.6 27.6,23.3 17.8,25.2 14.1,11.9 21.6,12.6 19.1,12.6 28.2,4.6 35,15.6 35,18.2
  pour Bottom (isolate 0.152, rank 2): 0.2,0.2 35.4,0.2 35.4,26.6 0.2,26.6
  pour Top (isolate 0.152, rank 2): 0.1,0.1 35.5,0.1 35.5,26.7 0.1,26.7
IPROPI0
  Bottom 0.305: R14.1 21.5,15.25 IC5.4
IPROPI1
  Bottom 0.305: R15.1 11.9,15.25 IC6.4
NFAULT0
  Bottom 0.305: R12.2 22.63,18.28 22.43,18.28 22,17.85 IC5.2
NFAULT1
  Bottom 0.305: R13.2 13.03,18.28 12.83,18.28 12.4,17.85 IC6.2
OUT1  (via drill 0.3)
  Top 0.305: v22.8,13.7 22.8,10.45 J2.6
  Bottom 0.305: IC5.6 20.25,14.85 21.4,13.7 v22.8,13.7
OUT2  (via drill 0.3)
  Top 0.305: v20.4,13.7 20.4,10.45 J2.5
  Bottom 0.305: IC5.8 19.25,14.85 v20.4,13.7
OUT3  (via drill 0.3)
  Top 0.305: v18,13.7 18,10.55 J2.4
  Bottom 0.305: IC6.6 10.65,15.25 11.6,14.3 14.7,14.3 14.8,14.4 15.58,14.4 15.64,14.34 17.36,14.34 v18,13.7
OUT4  (via drill 0.3)
  Top 0.305: v15.2,13.7 15.2,10.55 J2.3
  Bottom 0.305: IC6.8 9.65,15.45 11.4,13.7 v15.2,13.7
P0_PWM
  Bottom 0.305: IC5.16 20.75,20.89 JP1.2
  Bottom 0.406: D13.1 22.19,20.79 21.3,20.79 JP1.2
P0_PWM_INT
  Bottom 0.254: JP1.1 21.2,22.4 19.8,23.8 6,23.8 1.6,19.4 J1.1
P1_PWM_INT
  Top 0.254: J1.2 2.9,18.14 2.9,22.7 5.2,25 JP2.1
P2_PWM_INT
  Bottom 0.254: JP3.1 11.6,22.4 10.6,23.4 6.3,23.4 2.9,20 2.9,15.6 J1.3
P6_ADC  (via drill 0.25)
  Top 0.254: v8.4,7.41 8.79,7.41 10.6,5.6 10.6,3.6 12.9,1.3 23.6,1.3 29.3,7 v31.9,7 | v32.2,12.2 32.05,12.2 R5.2
  Bottom 0.254: JP4.2 7.01,7.99 7.6,7.4 v8.4,7.4 v8.4,7.41 | v31.9,7 32.4,7.5 32.4,12 v32.2,12.2
P6_ADC_INT
  Bottom 0.254: J1.7 2.86,5.4 4.8,5.4 6.19,6.79 JP4.1
P7_PWM
  Bottom 0.305: IC5.15 20.25,20.89 JP5.2
  Bottom 0.406: JP5.2 17.9,20.9 17.4,21.4 D11.1
P7_PWM_INT  (via drill 0.25)
  Top 0.127: v32.6,12.7 32.55,12.75 32.55,20.5 30.25,22.8 18,22.8 v17.8,23
  Bottom 0.127: J1.11 32.8,7.88 32.8,12.5 v32.6,12.7
  Bottom 0.254: v17.8,23 18.8,23 JP5.1
P8_PWM
  Bottom 0.305: IC6.15 10.65,20.89 JP6.2
  Bottom 0.406: JP6.2 8.1,20.9 D12.1
P8_PWM_INT  (via drill 0.25)
  Top 0.127: J1.12 32.8,10.42 32.8,12.3 33.1,12.6 33.1,13.3 32.8,13.6 32.8,20.7 29.3,24.2 9.2,24.2 v7.9,22.9
  Bottom 0.254: v7.9,22.9 9.2,22.9 JP6.1
P10_FSYNC  (via drill 0.41)
  Top 0.406: v24.2,14 24.2,8 24.8,7.4 v28.9,7.4
  Bottom 0.406: U1.2 28.5,8.2 28.9,7.8 v28.9,7.4 | IC4.4 24.15,13.95 v24.2,14 24.55,14.35 R7.2 24.55,16.55 24.8,16.8 26.8,16.8 v28.4,15.2 D8.1 31.19,14.6 JP7.2
P10_FSYNC_INT
  Bottom 0.406: J1.14 32.11,14.3 JP7.1
P12_PWM  (via drill 0.25)
  Top 0.127: v12.6,23 11.4,21.8 7.2,21.8 6.7,22.3 6.7,23 7.41,23.71 JP2.2
  Bottom 0.254: v12.6,23 12.6,20.79
  Bottom 0.305: IC6.16 11.15,20.89 JP3.2
  Bottom 0.406: D14.1 12.69,20.79 12.6,20.79 11.6,20.79 JP3.2
PMODE0  (via drill 0.25)
  Top 0.254: v19.7,19.8 20.7,20.8 v23.2,20.8
  Bottom 0.254: IC5.14 19.75,19.75 v19.7,19.8 | v23.2,20.8 23.8,20.8 23.8,19.8 24.6,19.8 JP10.2
PMODE1  (via drill 0.25)
  Top 0.254: v10.1,19.8 11,20.7 v13.6,20.7
  Bottom 0.254: IC6.14 10.15,19.75 v10.1,19.8 | v13.6,20.7 14.2,20.7 14.2,19.8 15,19.8 JP11.2
SW
  Bottom 0.406: IC1.1 L2.2
SYNC  (via drill 0.25)
  Top 0.254: v27.8,13.82 27.8,11.8 28,11.6 28,10.55 J2.8
  Bottom 0.254: JP9.2 27.9,13.7 27.8,13.8 v27.8,13.82
SYNC_IN
  Bottom 0.406: JP9.3 22.7,11.7 R10.2
SYNC_IN_INT
  Bottom 0.406: D7.1 21.75,10.55 R10.1 22.7,9.1 Z2.1 | Z2.1 24.8,8.35 25.25,7.9 R6.2 | Z2.1 IC4.2
SYNC_OUT
  Bottom 0.406: JP9.1 30.35,11.7 R9.2
SYNC_OUT_INT
  Bottom 0.406: R9.1 30.45,10.1 30,10.1 | 30,10.1 D9.1 | 30,10.1 30,8.95 U1.4
V_BATT  (via drill 0.25, 0.41)
  Top 0.254: v29.2,15.2 30.4,14 30.4,12 30.7,11.7 v31.8,11.7 | v14.6,17.2 15,17.6 19.6,17.6 20,18 20,19.3 20.7,20 24.8,20 24.85,19.95 | v23.9,17.5 24.7,17.5 25,17.8 25,19.8 24.85,19.95 | 24.85,19.95 26.3,21.4 28.8,21.4 29.4,22 30.5,22 31.95,20.55 C9.2 31.75,18.5 IC3.5 31.75,16.66 v31.91,16.5
  Top 0.406: v13.2,2 21.9,2 v26.6,6.7
  Bottom 0.254: v31.91,16.5 30.61,15.2 v29.2,15.2 | C11.2 32,8.45 32,11.5 v31.8,11.7 | C20.2 14.15,17.65 v14.6,17.2 | C18.2 23.75,17.65 v23.9,17.5
  Bottom 0.305: IC6.3 13.1,17.35 C20.2 | IC5.3 22.7,17.35 C18.2
  Bottom 0.406: IC1.4 12.25,2.05 C4.2 v13.2,2 | C11.2 31.1,7.55 U1.5 29.9,7.1 29.5,6.7 v26.6,6.7 26.55,6.75 R6.1
VCC  (via drill 0.25)
  Top 0.254: J1.8 2.9,2.9 4.8,2.9 5.7,3.8 5.7,13 7.2,14.5 13.7,14.5 v14.1,14.9 14.8,14.9 15.79,13.91 15.79,13.01 16.2,12.59 17,12.59 17.4,12.99 17.4,13.92 18.06,14.58 23.9,14.58 | v24.9,13.8 24.9,14.2 24.52,14.58 23.9,14.58 | v23.9,16.7 23.9,14.58 | D10.2 27.55,19.75 v27.5,19.7
  Bottom 0.254: J1.8 2.9,2.9 6.5,2.9 D2.1 | 25.45,13.8 v24.9,13.8 | v23.9,16.7 24.9,17.7 24.9,18.69 JP10.1 26.59,18.79 v27.5,19.7 | v14.1,14.9 15.2,16 JP11.1
  Bottom 0.305: IC6.1 11.9,18.7 13.15,19.95 R13.1 14.2,19.15 14.2,19 14.41,18.79 JP11.1 | IC5.1 21.5,18.7 22.75,19.95 R12.1 23.8,19.15 23.8,19 24.01,18.79 JP10.1
  Bottom 0.406: L2.1 8.6,4.25 C3.2 7.8,2.2 D2.1 | R7.1 25.65,15.7 25.65,14.8 C10.2 25.45,13.8 IC4.5
VCP0
  Bottom 0.305: C14.2 17.3,17.35 IC5.10
VCP1
  Bottom 0.305: IC6.10 7.7,17.35 C15.2
VIN
  Bottom 0.61: D1.1 32.84,5.3 J1.10

### Text on the board
tPlace: PWR - 6V to 36V | P1 | AIN - 0 to 5V or 4-20mA | SYN - 0 to 5V I/O | OpenMV | + | + | Driver / Shield / R1 | mA | PWR | GND | O4 | O3 | O2 | O1 | AIN | SYN
bPlace: Driver Shield R1 | https://openmv.io | P8 | P2 | 5.11.23 | P7 | P0 | L | L | H | H | FSYNC / P10 | I | O | ADC / P6 | VIN | RAW | GND | GND